# EAGLE design ostc_v2 (EAGLE 6.4)
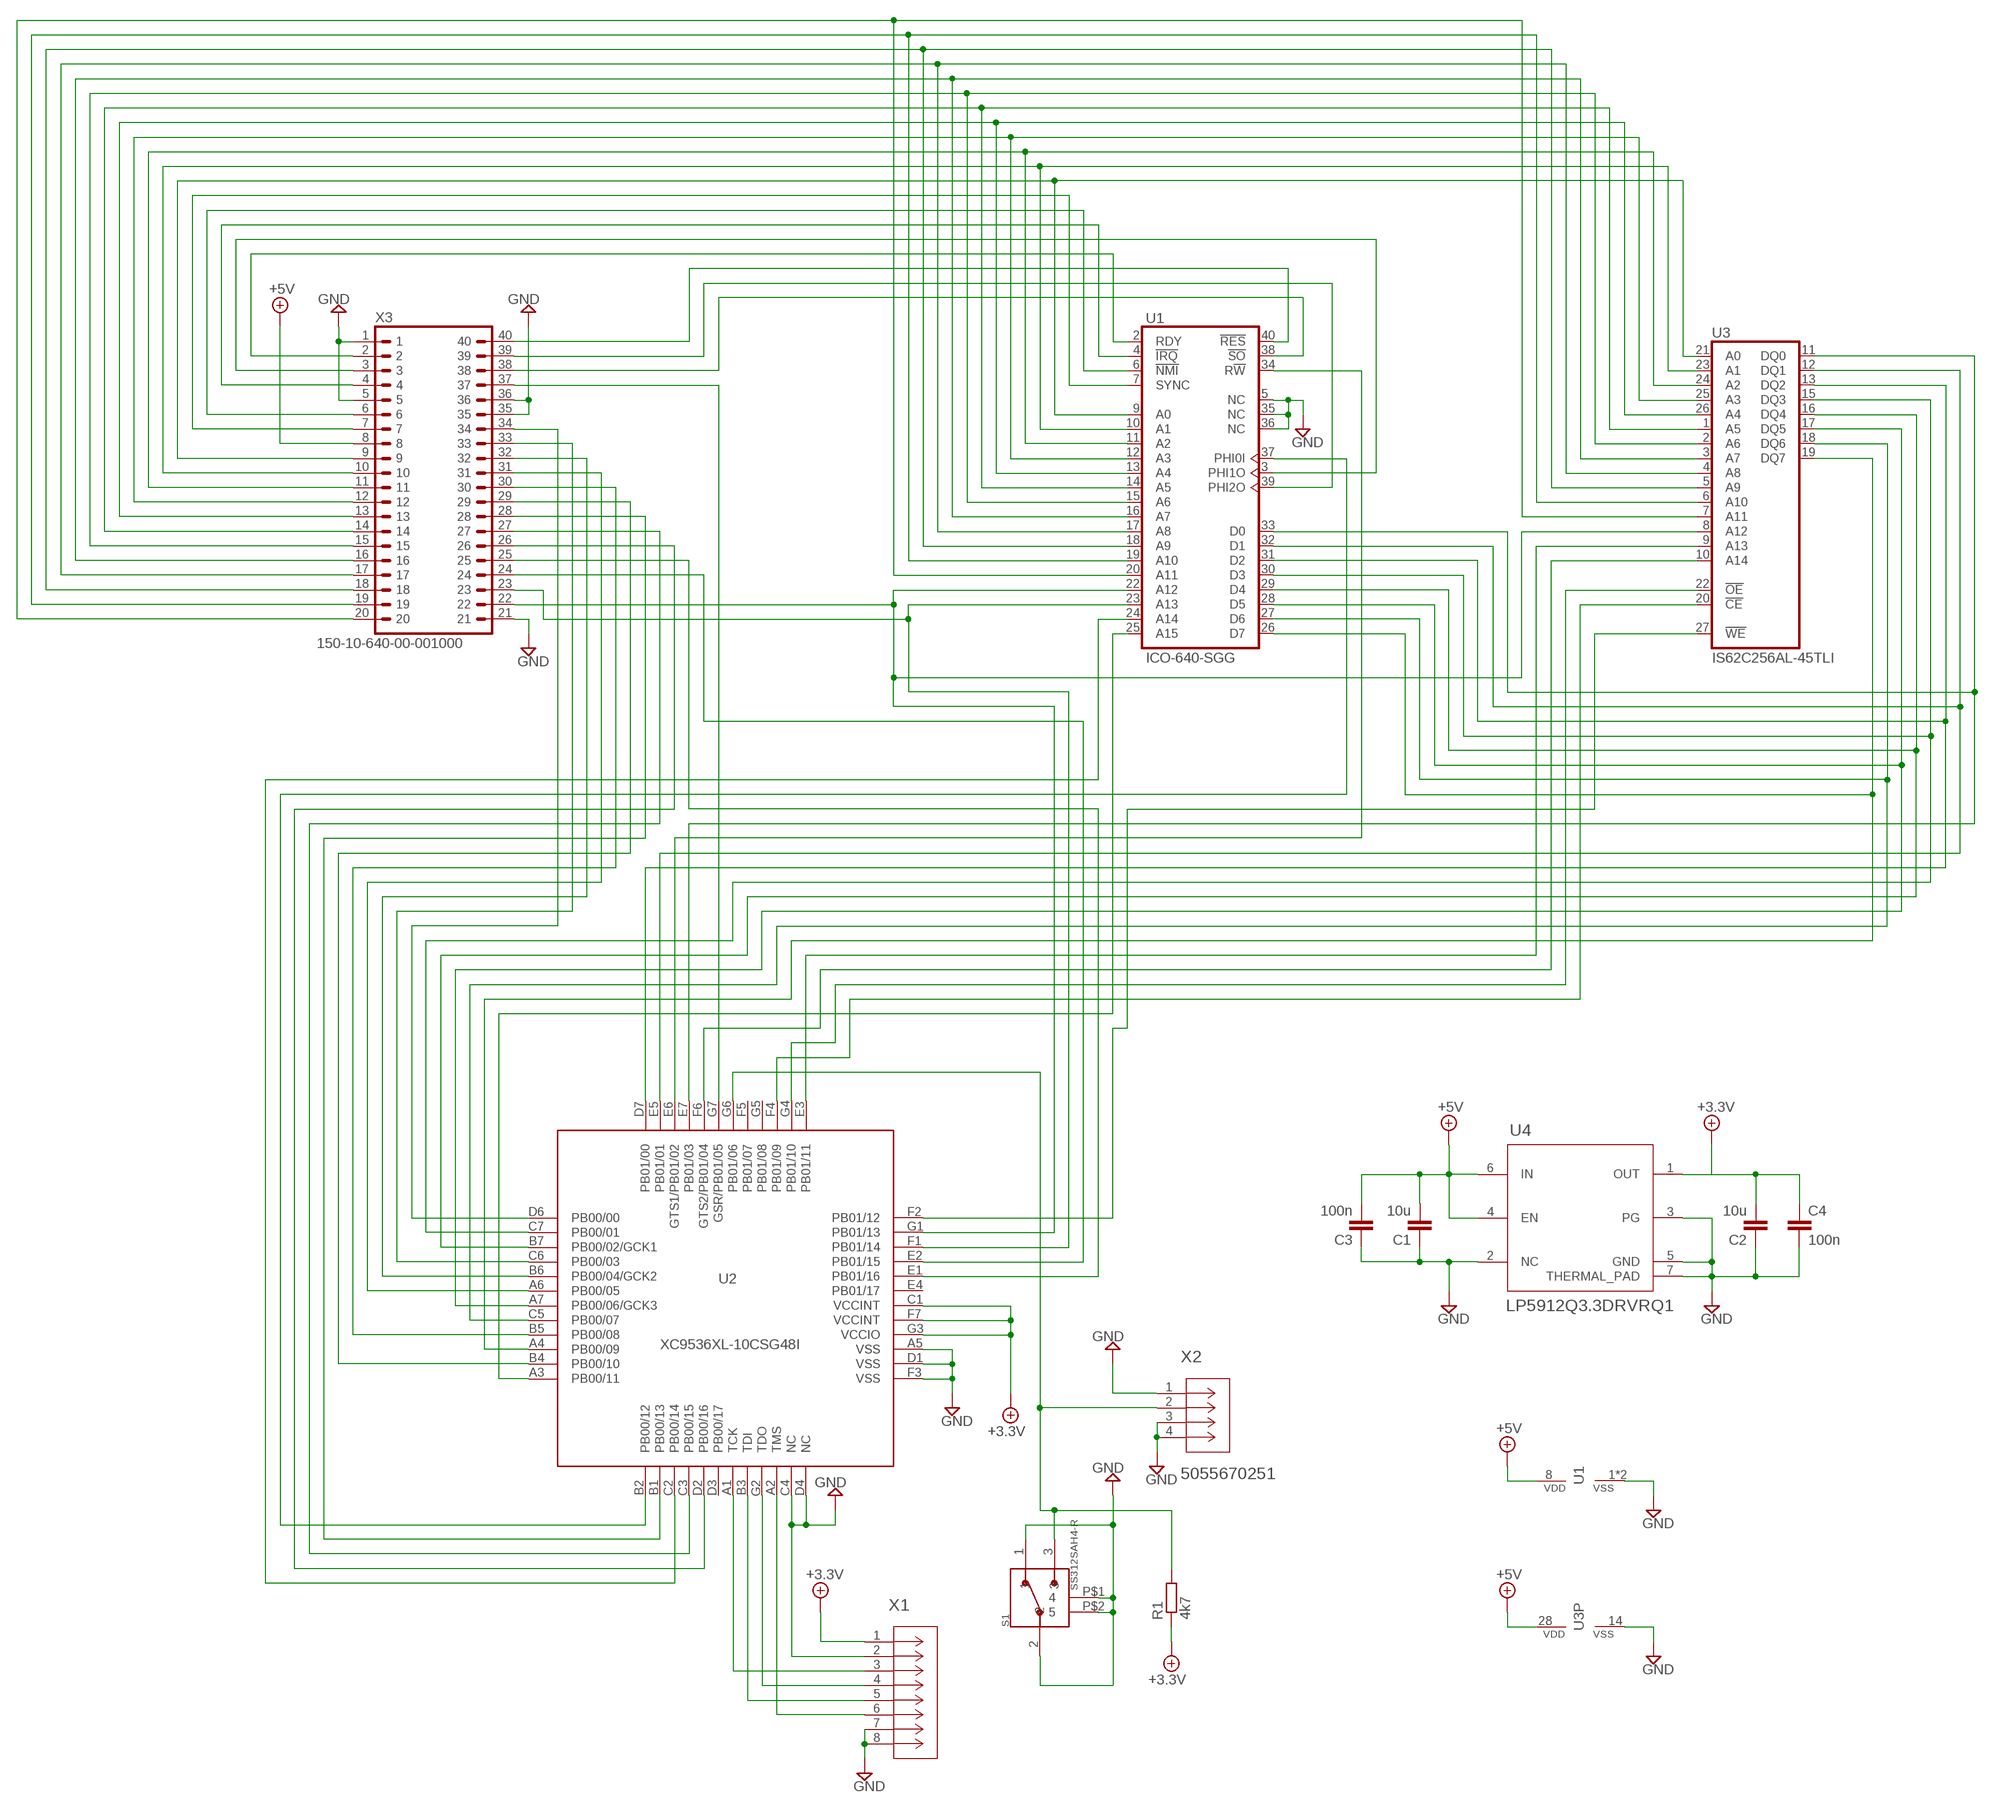
[diagram p0: schematic, sheet 1]

## Parts
C1  10u  C-EUC1206K  [C1206K]
C2  10u  C-EUC1206K  [C1206K]
C3  100n  C-EUC1206K  [C1206K]
C4  100n  C-EUC1206K  [C1206K]
R1  4k7  R-EU_R0805  [R0805]
S1  SS312SAH4-R  [SW_SS312SAH4-R]
U1  ICO-640-SGG  6502SAMTEC_ICO_S  [DIL40_LOWPROFILE]
U2  XC9536XL-10CSG48I  CX9536_CS48  [CSBGA48]
U3  IS62C256AL-45TLI  CY62256LL-ZC  [TSOP1-28]
U4  LP5912Q3.3DRVRQ1  LP5912-3.0DRVT  [DRV0006A-IPC_A]
X1  5055670651  [CON_5055670651]
X2  5055670251  [CON_5055670251]
X3  150-10-640-00-001000  DIL40  [DIL40]

## Nets
+3.3V: C2.2 C4.1 R1.1 U2.C1(VCCINT) U2.F7(VCCINT) U2.G3(VCCIO) U4.1(OUT) X1.1
+5V: C1.2 C3.2 U1.8(VDD) U3.28(VDD) U4.4(EN) U4.6(IN) X3.8
GND: C1.1 C2.1 C3.1 C4.2 S1.1 S1.2 S1.P$1 S1.P$2 U1.1(VSS) U1.5(NC) U1.21(VSS) U1.35(NC) U1.36(NC) U2.A5(VSS) U2.C4(NC) U2.D1(VSS) U2.D4(NC) U2.F3(VSS) U3.14(VSS) U4.2(NC) U4.3(PG) U4.5(GND) U4.7(THERMAL_PAD) X1.2 X1.7 X1.8 X2.1 X2.3 X2.4 X3.1 X3.5 X3.21 X3.35 X3.36
N$1: U1.2(RDY) X3.2
N$2: U1.3(PHI1O) X3.3
N$3: U1.4(!IRQ) X3.4
N$4: U1.6(!NMI) X3.6
N$5: U1.7(SYNC) X3.7
N$6: U1.9(A0) U3.21(A0) X3.9
N$7: U1.10(A1) U3.23(A1) X3.10
N$8: U1.11(A2) U3.24(A2) X3.11
N$9: U1.12(A3) U3.25(A3) X3.12
N$10: U1.13(A4) U3.26(A4) X3.13
N$11: U1.14(A5) U3.1(A5) X3.14
N$12: U1.15(A6) U3.2(A6) X3.15
N$13: U1.16(A7) U3.3(A7) X3.16
N$14: U1.17(A8) U3.4(A8) X3.17
N$15: U1.18(A9) U3.5(A9) X3.18
N$16: U1.19(A10) U3.6(A10) X3.19
N$17: U1.20(A11) U3.7(A11) X3.20
N$18: U2.E2(PB01/15) X3.24
N$19: U1.22(A12) U2.G1(PB01/13) U3.8(A12) X3.22
N$20: U1.23(A13) U2.F1(PB01/14) X3.23
N$21: U2.E1(PB01/16) X3.25
N$22: U2.D2(PB00/16) X3.26
N$23: U2.C3(PB00/15) X3.27
N$24: U2.B1(PB00/13) X3.28
N$25: U2.B4(PB00/10) X3.29
N$26: U2.B5(PB00/08) X3.30
N$27: U2.A6(PB00/05) X3.31
N$28: U2.B6(PB00/04/GCK2) X3.32
N$29: U2.C6(PB00/03) X3.33
N$30: U2.D6(PB00/00) X3.34
N$31: U2.G7(GSR/PB01/05) X3.37
N$32: U1.38(!SO) X3.38
N$33: U1.39(PHI2O) X3.39
N$34: U1.40(!RES) X3.40
N$35: U1.37(PHI0I) U2.B2(PB00/12)
N$36: U1.34(R!W) U2.E6(GTS1/PB01/02)
N$37: U1.33(D0) U2.E7(PB01/03) U3.11(DQ0)
N$38: U1.32(D1) U2.E5(PB01/01) U3.12(DQ1)
N$39: U1.31(D2) U2.D7(PB01/00) U3.13(DQ2)
N$40: U1.30(D3) U2.C7(PB00/01) U3.15(DQ3)
N$41: U1.29(D4) U2.B7(PB00/02/GCK1) U3.16(DQ4)
N$42: U1.28(D5) U2.A7(PB00/06/GCK3) U3.17(DQ5)
N$43: U1.27(D6) U2.C5(PB00/07) U3.18(DQ6)
N$44: U1.26(D7) U2.A4(PB00/09) U3.19(DQ7)
N$45: R1.2 S1.3 U2.G6(PB01/06) X2.2
N$47: U2.E3(PB01/11) U3.9(A13)
N$48: U2.F6(GTS2/PB01/04) U3.10(A14)
N$49: U2.G4(PB01/10) U3.22(!OE)
N$50: U2.F4(PB01/09) U3.20(!CE)
N$51: U2.F2(PB01/12) U3.27(!WE)
N$53: U1.25(A15) U2.A3(PB00/11)
N$54: U1.24(A14) U2.C2(PB00/14)
N$55: U2.A2(TMS) X1.6
N$56: U2.B3(TDI) X1.5
N$57: U2.G2(TDO) X1.4
N$58: U2.A1(TCK) X1.3
Unconnected: U2.D3(PB00/17) U2.E4(PB01/17) U2.F5(PB01/07) U2.G5(PB01/08)

## Library data of the parts
C1-C4 = resistor:C-EU: CAPACITOR, European symbol
R1 = resistor:R-EU_: RESISTOR, European symbol
S1 = SS312SAH4-R:SS312SAH4-R: Switch Slide ON None ON SPDT Side Slide 0.1A 28VAC 28VDC 0.4VA 10000Cycles Gull Wing SMD T/R; MANUFACTURER: NKK switches
U1 = 6502:6502: R6502 by Rockwell
U2 = xilinx-xc9:CX9536_CS48
U3 = memory-sram:CY62256LL-?*: 256K (32K x 8) CMOS-Static RAM Source: http://download.cypress.com.edgesuite.net/design_resources/datasheets/contents/cy62256_8.pdf
U4 = texas:LP5912-3.0DRVT; COPYRIGHT: Copyright (C) 2024 Ultra Librarian. All rights reserved.; MANUFACTURER_PART_NUMBER: LP5912-3.0DRVT; MFR_NAME: Texas Instruments; REFDES: RefDes; TYPE: TYPE
X1 = con-molex:5055670651; COPYRIGHT: Copyright (C) 2024 Ultra Librarian. All rights reserved.; MANUFACTURER_PART_NUMBER: 5055670651; MFR_NAME: Molex Connector Corporation
X2 = con-molex:5055670251; COPYRIGHT: Copyright (C) 2024 Ultra Librarian. All rights reserved.; MANUFACTURER_PART_NUMBER: 5055670251; MFR_NAME: Molex Connector Corporation
X3 = DIL-header:DIL40: DIL Header 40-pin

## Board
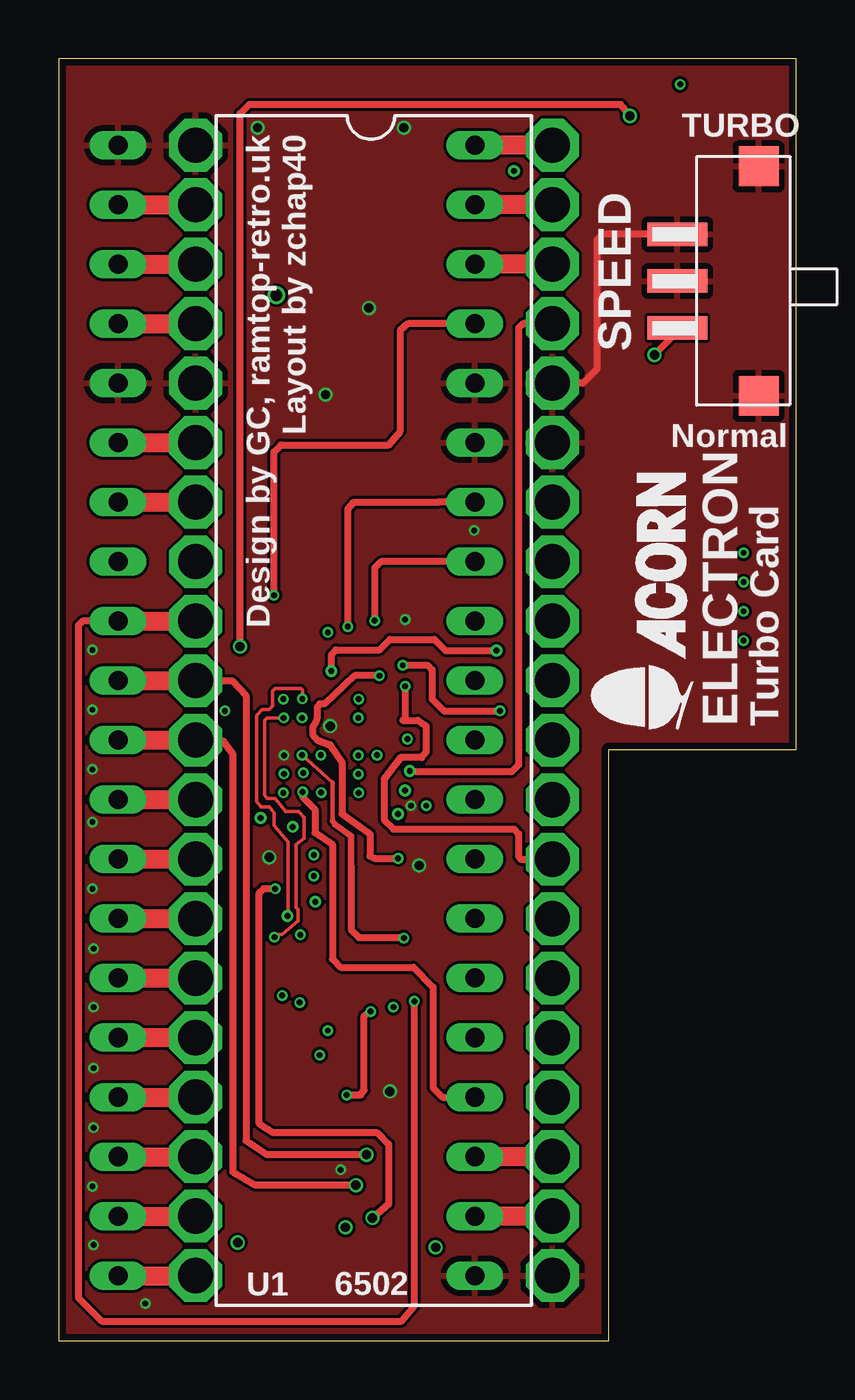
[diagram p1: board, top side]
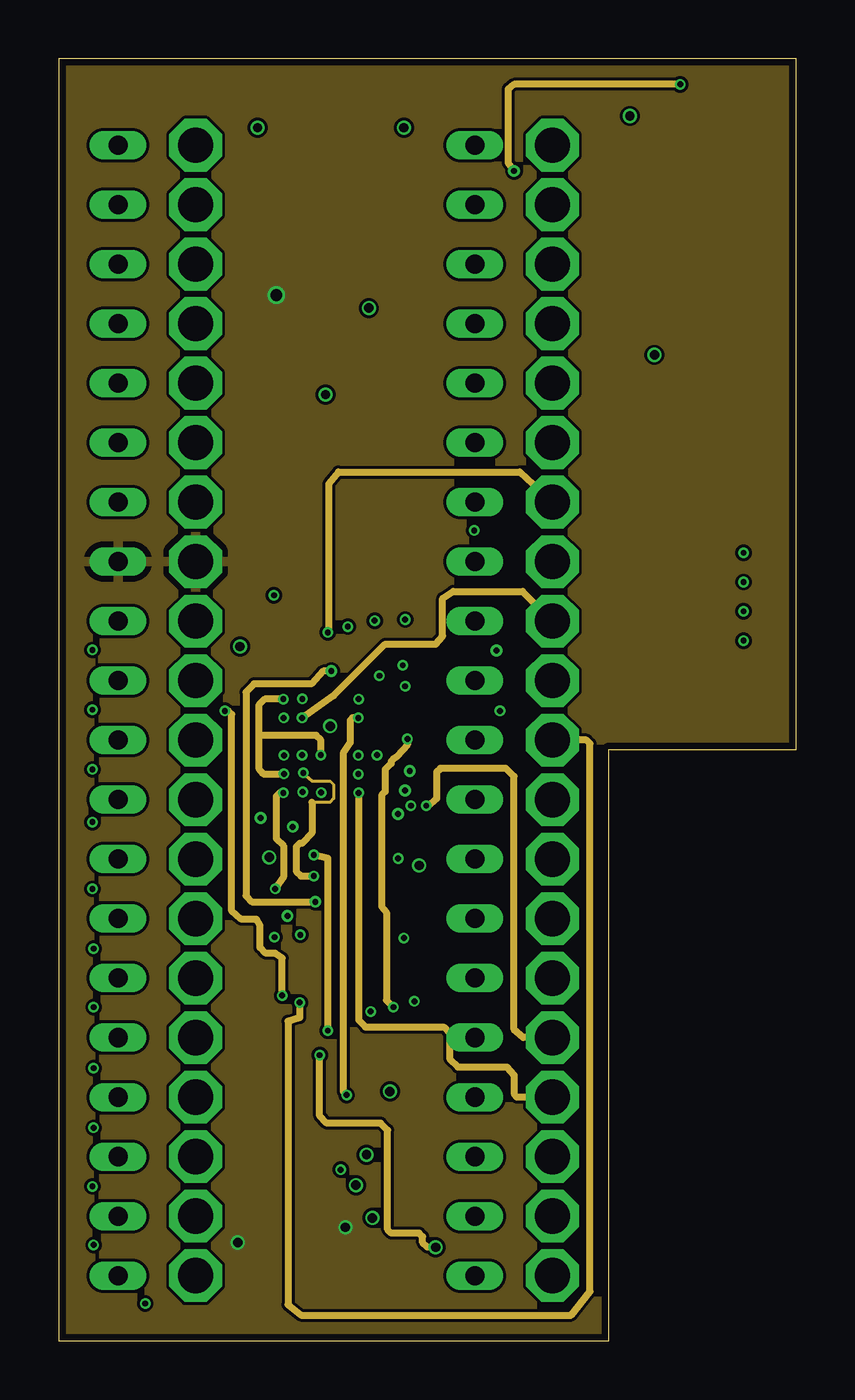
[diagram p2: board, inner layer Route2]
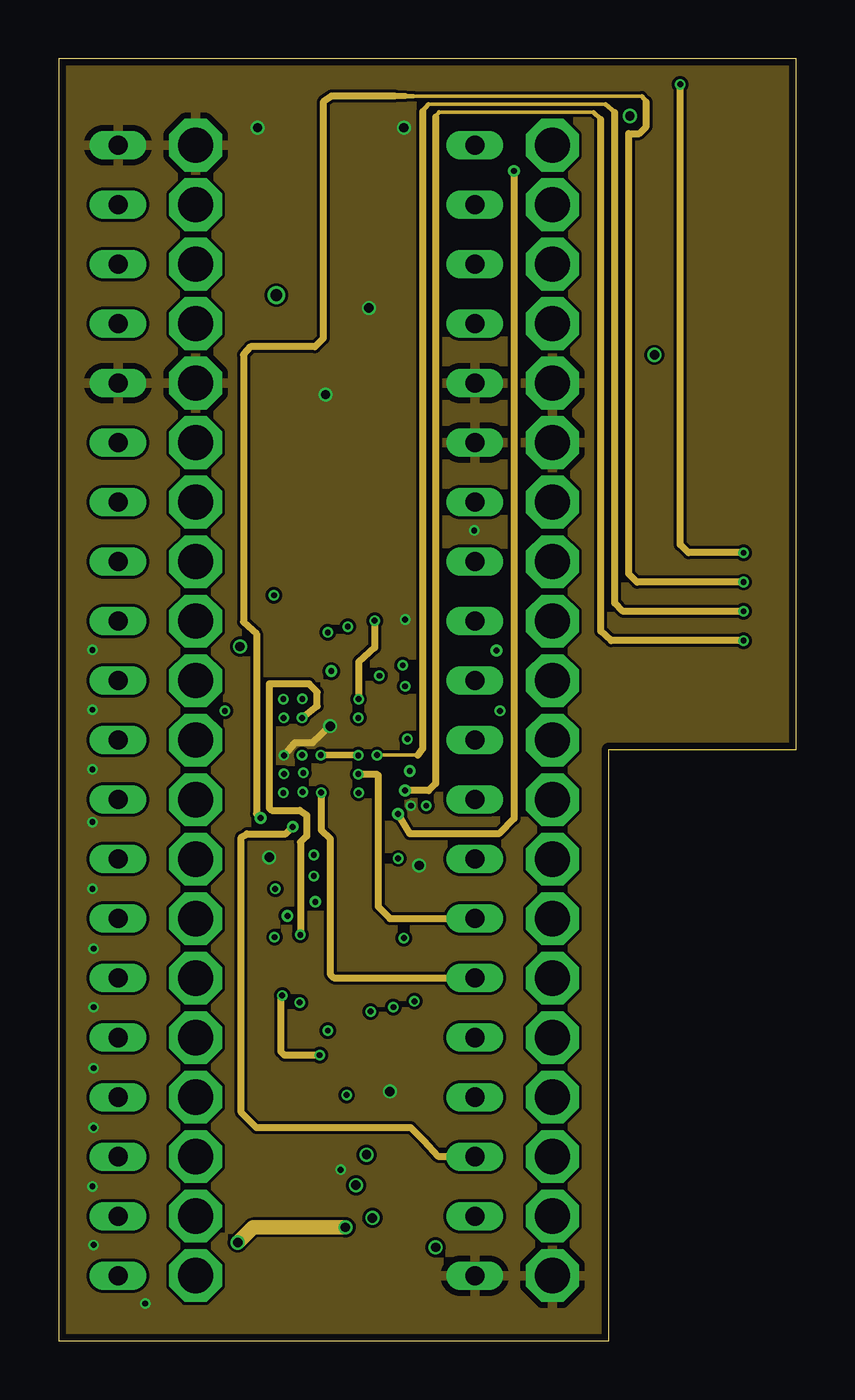
[diagram p3: board, inner layer Route15]
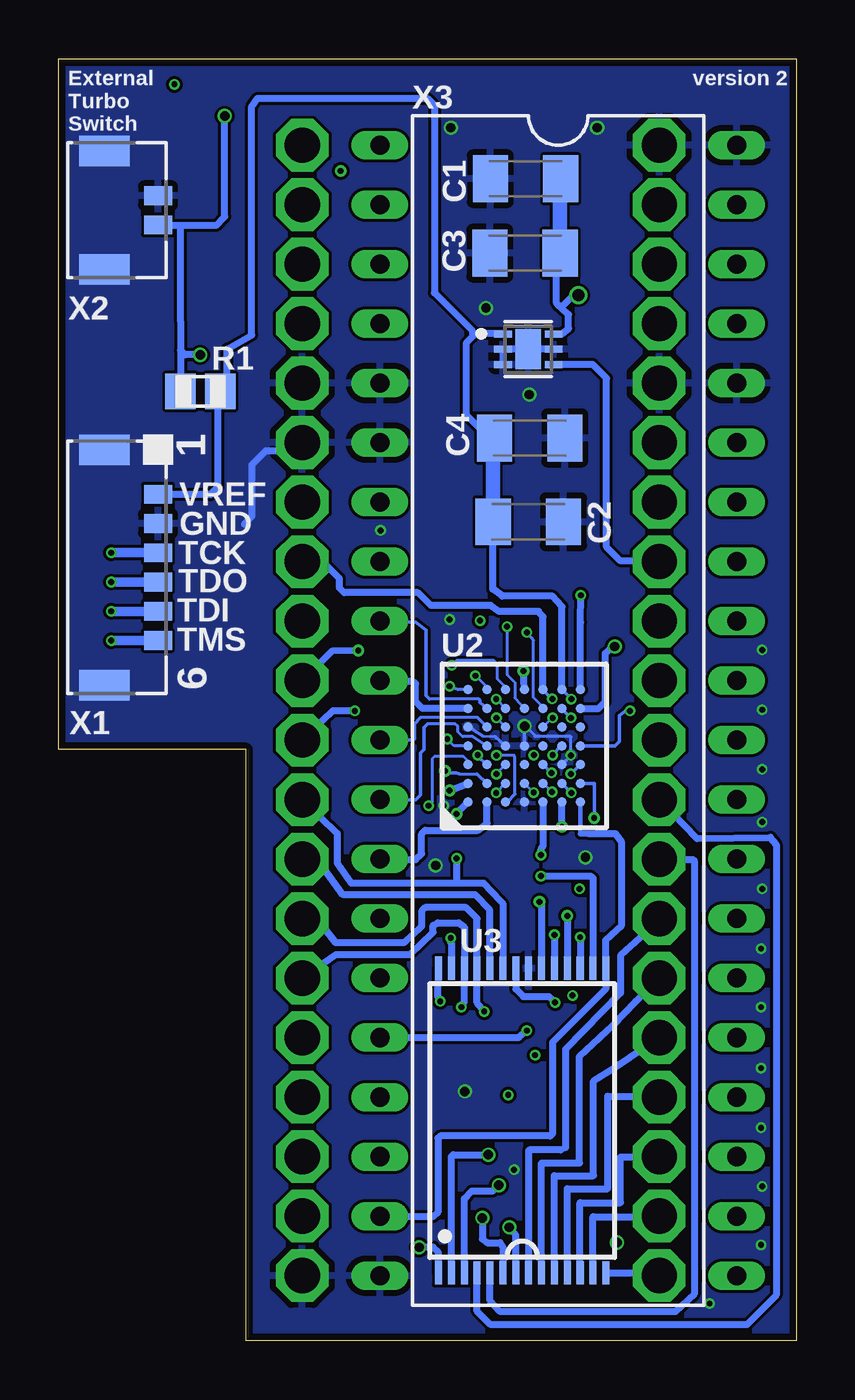
[diagram p4: board, bottom side, seen from below]

Size 31.5 x 54.75 mm. Coordinates in mm from the lower left corner, seen from the top.
Outline: 0,0 23.5,0 23.5,25.25 31.5,25.25 31.5,54.75 0,54.75 0,0
Copper layers (1+2*15+16): Top 0.035mm / dielectric 0.138mm / Route2 0.035mm / dielectric 1.13mm / Route15 0.035mm / dielectric 0.138mm / Bottom 0.035mm
Design rules "aisler_4_layer_complex *": minimum track width 0.125mm, minimum drill 0.1mm, track to track 0.125mm, track to pad 0.125mm, pad to pad 0.125mm, via to via 0.125mm, smd to smd 0mil, copper to edge 0.3mm, drill to drill 0.3mm, minimum pad ring 0.2mm, minimum via ring 0.1mm, stop-mask expansion 0mil, vias tented up to drill 0.3mm, thermal gap 10mil

### Footprints (pad centres in the part's own frame; a part is rotated, then mirrored left to right if it is on the bottom)
C1206K = smd 1.5 x 2: 1 -1.5,0; 2 1.5,0
R0805 = smd 1.3 x 1.5: 1 -0.85,0; 2 0.85,0
SW_SS312SAH4-R = smd 2.55 x 1: 1 1.525,-2; 2 1.525,0; 3 1.525,2 | smd 1.7 x 1.7: P$1 -1.95,-4.9; P$2 -1.95,4.9
DIL40_LOWPROFILE = drill 1.5 octagon: 1 -24.13,-7.62; 2 -21.59,-7.62; 3 -19.05,-7.62; 4 -16.51,-7.62; 5 -13.97,-7.62; 6 -11.43,-7.62; 7 -8.89,-7.62; 8 -6.35,-7.62; 9 -3.81,-7.62; 10 -1.27,-7.62; 11 1.27,-7.62; 12 3.81,-7.62; 13 6.35,-7.62; 14 8.89,-7.62; 15 11.43,-7.62; 16 13.97,-7.62; 17 16.51,-7.62; 18 19.05,-7.62; 19 21.59,-7.62; 20 24.13,-7.62; 21 24.13,7.62; 22 21.59,7.62; 23 19.05,7.62; 24 16.51,7.62; 25 13.97,7.62; 26 11.43,7.62; 27 8.89,7.62; 28 6.35,7.62; 29 3.81,7.62; 30 1.27,7.62; 31 -1.27,7.62; 32 -3.81,7.62; 33 -6.35,7.62; 34 -8.89,7.62; 35 -11.43,7.62; 36 -13.97,7.62; 37 -16.51,7.62; 38 -19.05,7.62; 39 -21.59,7.62; 40 -24.13,7.62
CSBGA48 = smd 0.4 x 0.4: A1 -2,2.8; A2 -1.2,2.8; A3 -0.4,2.8; A4 0.4,2.8; A5 1.2,2.8; A6 2,2.8; A7 2.8,2.8; B1 -2,2; B2 -1.2,2; B3 -0.4,2; B4 0.4,2; B5 1.2,2; B6 2,2; B7 2.8,2; C1 -2,1.2; C2 -1.2,1.2; C3 -0.4,1.2; C4 0.4,1.2; C5 1.2,1.2; C6 2,1.2; C7 2.8,1.2; D1 -2,0.4; D2 -1.2,0.4; D3 -0.4,0.4; D4 0.4,0.4; D6 2,0.4; D7 2.8,0.4; E1 -2,-0.4; E2 -1.2,-0.4; E3 -0.4,-0.4; E4 0.4,-0.4; E5 1.2,-0.4; E6 2,-0.4; E7 2.8,-0.4; F1 -2,-1.2; F2 -1.2,-1.2; F3 -0.4,-1.2; F4 0.4,-1.2; F5 1.2,-1.2; F6 2,-1.2; F7 2.8,-1.2; G1 -2,-2; G2 -1.2,-2; G3 -0.4,-2; G4 0.4,-2; G5 1.2,-2; G6 2,-2; G7 2.8,-2
TSOP1-28 = smd 1 x 0.3: 1 -6.5,-0.275; 2 -6.5,-0.825; 3 -6.5,-1.375; 4 -6.5,-1.925; 5 -6.5,-2.475; 6 -6.5,-3.025; 7 -6.5,-3.575; 8 6.5,-3.575; 9 6.5,-3.025; 10 6.5,-2.475; 11 6.5,-1.925; 12 6.5,-1.375; 13 6.5,-0.825; 14 6.5,-0.275; 15 6.5,0.275; 16 6.5,0.825; 17 6.5,1.375; 18 6.5,1.925; 19 6.5,2.475; 20 6.5,3.025; 21 6.5,3.575; 22 -6.5,3.575; 23 -6.5,3.025; 24 -6.5,2.475; 25 -6.5,1.925; 26 -6.5,1.375; 27 -6.5,0.825; 28 -6.5,0.275
DRV0006A-IPC_A = smd 0.756 x 0.292: 1 -1.078,0.65; 2 -1.078,0; 3 -1.078,-0.65; 4 1.078,-0.65; 5 1.078,0; 6 1.078,0.65 | smd 1.1 x 1.7: 7 0,0
CON_5055670651 = smd 0.8 x 1.2: 1 0,0; 2 -1.25,0; 3 -2.5,0; 4 -3.75,0; 5 -5,0; 6 -6.25,0 | smd 1.3 x 2.15: 7 1.9,2.295; 8 -8.15,2.295
CON_5055670251 = smd 0.8 x 1.2: 1 0,0; 2 -1.25,0 | smd 1.3 x 2.15: 3 1.9,2.295; 4 -3.15,2.295
DIL40 = drill 0.813 long: 1 -24.13,-7.62; 2 -21.59,-7.62; 3 -19.05,-7.62; 4 -16.51,-7.62; 5 -13.97,-7.62; 6 -11.43,-7.62; 7 -8.89,-7.62; 8 -6.35,-7.62; 9 -3.81,-7.62; 10 -1.27,-7.62; 11 1.27,-7.62; 12 3.81,-7.62; 13 6.35,-7.62; 14 8.89,-7.62; 15 11.43,-7.62; 16 13.97,-7.62; 17 16.51,-7.62; 18 19.05,-7.62; 19 21.59,-7.62; 20 24.13,-7.62; 21 24.13,7.62; 22 21.59,7.62; 23 19.05,7.62; 24 16.51,7.62; 25 13.97,7.62; 26 11.43,7.62; 27 8.89,7.62; 28 6.35,7.62; 29 3.81,7.62; 30 1.27,7.62; 31 -1.27,7.62; 32 -3.81,7.62; 33 -6.35,7.62; 34 -8.89,7.62; 35 -11.43,7.62; 36 -13.97,7.62; 37 -16.51,7.62; 38 -19.05,7.62; 39 -21.59,7.62; 40 -24.13,7.62

### Placement (x,y rotation side)
C1  11.56,49.62 0 bottom
C2  11.44,34.97 180 bottom
C3  11.58,46.44 0 bottom
C4  11.38,38.55 0 bottom
R1  25.44,40.54 180 bottom
S1  27.95,45.25 180 top
U1  13.47,26.92 270 top
U2  11.21,25.01 90 bottom
U3  11.7,9.41 90 bottom
U4  11.44,42.34 0 bottom
X1  27.25,36.15 90 bottom
X2  27.25,48.9 90 bottom
X3  10.16,26.92 270 top

### Tracks (layer width: path | path; a pad name or v marks a point on that pad's centre or on a via)
+3.3V  (via drill 0.25)
  Route2 0.305: v11.2,25.01 11.2,25.65 11,25.85 8.55,25.85 | 8.55,25.85 8.55,24.45 8.74,24.21 v9.62,24.21 | v9.6,27.4 8.8,27.4 8.55,27.15 8.55,25.85
  Route15 0.305: v12.8,25 v11.2,25.01
  Bottom 0.125: 12.01,23.35 12.01,24.95 12.05,25 v12.8,25
  Bottom 0.15: U2.G3 9.57,24.25 v9.62,24.21 | U2.F7 10.01,27.76 9.96,27.76 v9.6,27.4 | U2.C1 12.34,23.01 12.01,23.35
  Bottom 0.305: U4.1 13.7,43 13.82,42.88 | 13.82,42.88 14.1,42.6 14.1,39.55 13.1,38.55 C4.1 | U2.F7 10,31.35 10.4,31.8 12.55,31.8 12.95,32.1 C2.2 | 13.82,42.88 13.82,43.12 15.45,44.75 15.45,52.75 15.75,53.05 23,53.05 23.25,52.7 23.25,42.95 24.3,42.35 24.3,40.6 24.65,40.6 R1.1 24.7,40.43 24.7,36.45 25.02,36.12 27.25,36.12 X1.1
  Bottom 0.61: C2.2 12.94,38.49 C4.1
+5V  (via drill 0.4, 0.5)
  Route15 0.61: v12.25,4.85 8.3,4.85 v7.65,4.2
  Bottom 0.305: U1.8 5.88,33.3 7.5,33.3 8.1,33.9 8.1,41.1 8.69,41.69 U4.4 | U4.6 10,43 9.73,43.23 9.73,43.83 10.05,44.11 | C3.2 10.25,46.16 10.25,44.35 10.18,44.23 10.05,44.11 | U3.28 11.97,4.51 v12.25,4.85 | v9.3,44.65 9.51,44.65 10.05,44.11
  Bottom 0.61: C3.2 10.08,49.6 C1.2
  pour Route2: 0,0 0,54.75 31.5,54.75 31.5,25.25 23.5,25.25 23.5,0
GND  (via drill 0.25 pad 0.4, 0.25 pad 0.45, 0.4, 0.4 pad 0.45)
  Top 0.305: S1.1 23.25,47.25 23,47 23,41.5 22.39,40.89 U1.36
  Route15 0.305: v9.62,25 9.62,25.02 10.1,25.55 10.85,25.55 v11.6,26.25
  Bottom 0.125: 13.78,26.09 13.38,25.82 12.86,25.81 | v9.62,25 9.61,25.8 11.15,25.8 11.15,25.85 11.55,26.25 v11.6,26.25
  Bottom 0.15: 12.38,25.41 U2.C4 12.86,25.81 | U2.A5 13.88,26.21 13.78,26.09 | U2.D4 v11.6,26.25 | U2.F3 v9.62,25
  Bottom 0.305: 13,49.68 C1.1 12.95,49.51 | U4.3 U4.2 11.56,42.34 11.5,42.4 U4.7 U4.5 | 10.4,38.62 C4.2 10.35,38.52 | U1.35 21.44,38 22.65,38 23.25,37.4 23.25,35.2 23.57,34.88
  other vias: 9,20.65 1.45,29.5 1.45,26.95 1.45,24.4 1.45,19.3 1.5,16.75 1.5,14.25 1.5,11.65 1.5,9.1 1.45,6.6 1.5,4.1 15.4,20.3 14.15,10.65 11.4,40.4 13.25,44.1 14.75,51.8 8.5,51.8 3.7,1.6 1.45,22.15 17.75,34.6 12.05,7.31 15.05,22.85 14.8,30.8
  pour Route15: 0,54.75 31.5,54.75 31.5,25.25 23.5,25.25 23.5,0 0,0
  pour Bottom: 0,54.75 31.5,54.75 31.5,25.25 23.5,25.25 23.5,0 0,0
  pour Top: 0,54.75 31.5,54.75 31.5,25.25 23.5,25.25 23.5,0 0,0
N$1
  Top 0.813: X3.2 U1.2
N$2
  Top 0.813: X3.3 U1.3
N$3
  Top 0.813: X3.4 U1.4
N$4
  Top 0.813: X3.6 U1.6
N$5
  Top 0.813: X3.7 U1.7
N$6  (via drill 0.25)
  Top 0.305: U1.9 1.03,30.73 0.85,30.55 0.85,1.85 1.85,0.85 14.65,0.85 15.2,1.5 v15.2,14.5
  Top 0.813: X3.9 U1.9
  Bottom 0.305: v15.2,14.5 15.3,14.7 15.29,15.9 U3.21
N$7  (via drill 0.4)
  Top 0.305: U1.10 7.41,28.19 8,27.55 8,8.55 8.9,7.95 v13.15,7.95
  Top 0.813: X3.10 U1.10
  Bottom 0.305: U3.23 14.72,7.88 14.65,7.95 v13.15,7.95
N$8  (via drill 0.4)
  Top 0.305: v12.7,6.65 8.4,6.65 7.45,7.2 7.45,25.05 7.05,25.6 5.9,25.6 U1.11
  Top 0.813: X3.11 U1.11
  Bottom 0.305: U3.24 14.18,6.08 13.85,6.4 12.95,6.4 v12.7,6.65
N$9
  Top 0.813: X3.12 U1.12
  Bottom 0.305: U1.12 4.24,21.45 1.1,21.5 0.85,21.2 0.85,1.95 2.1,0.7 13.05,0.7 13.62,1.27 U3.25
N$10
  Top 0.813: X3.13 U1.13
  Bottom 0.305: U1.13 5.83,20.55 4.4,20.55 4.35,20.5 4.35,2 5.15,1.25 12.65,1.25 13.07,1.73 U3.26
N$11
  Top 0.813: X3.14 U1.14
  Bottom 0.305: U1.14 5.85,17.95 7.5,16.45 7.5,14.85 9.85,12.45 9.85,8.25 10.05,8.15 11.4,8.15 11.43,8.12 U3.1
N$12
  Top 0.813: X3.15 U1.15
  Bottom 0.305: U3.2 10.88,7.6 9.25,7.6 9.25,12.15 7.8,13.5 6.85,14.5 5.85,15.45 U1.15
N$13
  Top 0.813: X3.16 U1.16
  Bottom 0.305: U3.3 10.33,7.05 8.65,7.05 8.65,11.1 7.7,11.7 U1.16
N$14
  Top 0.813: X3.17 U1.17
  Bottom 0.305: U3.4 9.77,6.46 9.77,6.5 8.05,6.5 8.05,10.45 5.85,10.45 U1.17
N$15
  Top 0.813: X3.18 U1.18
  Bottom 0.305: U3.5 9.23,5.9 7.5,5.9 7.5,7.85 5.85,7.85 U1.18
N$16
  Top 0.813: X3.19 U1.19
  Bottom 0.305: U3.6 8.68,5.3 5.85,5.3 U1.19
N$17
  Top 0.813: X3.20 U1.20
  Bottom 0.305: U3.7 5.85,2.91
  Bottom 0.406: 5.85,2.91 U1.20
N$18  (via drill 0.25 pad 0.45)
  Top 0.305: v10.43,23.44 10.43,23.23 10.95,22.7 10.95,21.7 11.7,21.2 11.7,16.3 12.05,15.95 15.15,15.95 16,15.1 16,10.8 16.4,10.4 X3.24
  Bottom 0.125: U2.E2 10.8,23.81 v10.43,23.44
N$19
  Top 0.813: U1.22 X3.22
  Bottom 0.2: 9.21,21.65 U2.G1
  Bottom 0.25: 8.85,21.65 9.21,21.65
  Bottom 0.275: 8.55,21.65 8.85,21.65
  Bottom 0.305: U3.8 8.13,17.12 7.45,17.75 7.45,21.3 7.7,21.65 8.55,21.65 | U3.8 | U3.8 8.13,15.02 10.4,12.75 10.4,8.85 10.5,8.75 15.2,8.75 15.3,8.65 15.3,5.5 15.5,5.3 17.75,5.3 X3.22
N$20  (via drill 0.25 pad 0.5)
  Top 0.813: U1.23 X3.23
  Route15 0.305: X3.23 16.23,7.87 15.6,8.55 15.05,9.1 8.45,9.1 7.8,9.75 7.8,21.5 8.05,21.65 9.7,21.65 v10,21.95
  Bottom 0.305: v10,21.95 U2.F1
N$21  (via drill 0.25 pad 0.45)
  Route2 0.305: v11.5,13.25 11.5,20.6 v10.9,20.75
  Bottom 0.305: X3.25 11.85,12.95 v11.5,13.25 | v10.9,20.75 10.9,21 10.8,21.15 U2.E1
N$22  (via drill 0.25 pad 0.45)
  Route15 0.305: v11.21,23.41 11.21,21.81 11.6,21.45 11.6,15.65 11.75,15.5 X3.26
  Bottom 0.125: U2.D2 v11.21,23.41
N$23  (via drill 0.25 pad 0.45)
  Route15 0.305: v12.8,24.2 13.6,24.2 13.65,24.15 13.65,18.55 14.15,18.04 X3.27
  Bottom 0.125: U2.C3 12.44,24.61 v12.8,24.2
N$24
  Bottom 0.305: X3.28 17.76,20.55 16.25,20.55 16,20.8 16,21.65 15.85,21.8 13.6,21.8 13.2,22.1 U2.B1
N$25
  Bottom 0.125: U2.B4 13.8,25.8 14.25,25.8 14.45,26 14.45,26.25 14.55,26.35 15.75,26.35
  Bottom 0.15: 15.75,26.35 15.9,26.2 15.9,25.25 16.05,25.1 16.05,23.3 16.25,23.1 X3.29
N$26
  Bottom 0.125: 13.6,26.61 16.05,26.61
  Bottom 0.15: U2.B5 13.6,26.61 | 16.05,26.61 16.3,26.35 16.3,25.7 16.35,25.65 X3.30
N$27
  Bottom 0.305: U2.A6 15.96,27.01 16.25,27.3 16.25,28.05 16.35,28.15 17.74,28.15 X3.31
N$28
  Bottom 0.125: 13.5,27.35 13.55,27.41 15.66,27.41
  Bottom 0.15: U2.B6 13.5,27.25 13.5,27.35 | 15.66,27.41 15.8,27.55 15.8,30.35 16.25,30.7 17.75,30.7 X3.32
N$29  (via drill 0.25 pad 0.45)
  Top 0.305: X3.33 13.78,33.27 13.5,33 v13.5,30.75
  Route15 0.305: v13.5,30.75 13.5,29.6 12.81,28.99 v12.81,27.4
  Bottom 0.125: v12.81,27.4 v12.8,27.4 U2.C6
N$30  (via drill 0.25 pad 0.45)
  Top 0.305: X3.34 16.21,35.81 16.15,35.8 | 16.2,35.8 16.15,35.8 | 16.15,35.8 12.6,35.8 12.35,35.5 v12.35,30.5
  Bottom 0.125: v12.35,30.5 12.35,28.45 12.01,28.11 12.01,27.45 U2.D6
N$31  (via drill 0.25 pad 0.45)
  Top 0.305: v9.2,31.84 9.2,37.95 9.5,38.25 14.1,38.25 14.6,38.85 14.6,43.15 14.95,43.45 17.76,43.45 X3.37
  Bottom 0.305: U2.G7 9.21,30.69 v9.2,31.84
N$32
  Top 0.813: U1.38 X3.38
N$33
  Top 0.813: U1.39 X3.39
N$34
  Top 0.813: U1.40 X3.40
N$35  (via drill 0.25 pad 0.5)
  Top 0.305: U1.37 19.83,43.43 19.65,43.25 19.65,24.6 19.35,24.3 15.25,24.3 v15,24.34
  Bottom 0.125: 14.38,24.21 13.62,24.21
  Bottom 0.15: v15,24.34 14.8,24.25 14.5,24.25 14.38,24.21 | 13.62,24.21 U2.B2
N$36  (via drill 0.25 pad 0.45)
  Route2 0.305: v11.5,30.25 11.5,30.3 11.55,30.35 11.55,36.6 11.95,37.1 19.7,37.1 U1.34
  Bottom 0.125: U2.E6 10.81,27.06 11.21,27.46 11.21,29.91 v11.5,30.25
N$37  (via drill 0.25 pad 0.45, 0.25 pad 0.5)
  Top 0.15: v10.41,27.41 10.41,27.79 10.35,27.85 9.25,27.85 9.15,27.75 9.15,27.1 9,26.95 8.7,26.95 8.46,26.7 8.46,23.04 8.65,22.8 9.01,22.8 9.2,22.55 9.2,22 9.55,21.6 9.8,21.3 9.8,18.2 v9.78,18.15
  Bottom 0.15: U2.E7 10.81,27.76 v10.41,27.41 | 9.78,15.94 U3.11
  Bottom 0.305: U2.E7 10.81,30.91 11,31.15 12.7,31.15 13.05,31.4 15.6,31.4 16.15,31.95 19.3,31.95 19.5,32.15 19.5,32.55 20.22,33.27 U1.33 | v9.78,18.15 9.78,15.94
N$38  (via drill 0.25 pad 0.45)
  Route2 0.305: U1.32 19.82,32 16.85,32 16.4,31.7 16.4,30.1 16.1,29.75 13.95,29.75 11.75,27.55 v10.4,26.6
  Route15 0.305: v10.32,17.34 10.32,21.3 10.6,21.55 10.6,22.45 10.3,22.65 9.1,22.65 9,22.75 9,28.05 10.7,28.05 11.05,27.7 11.05,27.1 v10.4,26.6
  Bottom 0.125: U2.E5 10.81,26.24 v10.4,26.6
  Bottom 0.305: v10.32,17.34 U3.12
N$39  (via drill 0.25 pad 0.5)
  Top 0.305: v11.65,28.6 11.65,29.3 11.85,29.5 13.7,29.5 14.15,29.95 16.05,29.95 16.52,29.48 v18.7,29.48
  Route2 0.305: v11.65,28.6 11.3,28.6 10.8,28.05 8.35,28.05 8,27.7 8,19 8.25,18.75 v10.96,18.75
  Bottom 0.15: U2.D7 11.61,28.59 v11.65,28.6
  Bottom 0.305: U2.D7 v11.65,28.6 | v18.7,29.48 19.83,29.45 U1.31 | v10.96,18.75 10.88,18.61 U3.13
N$40  (via drill 0.25 pad 0.45)
  Top 0.305: v14.7,28.85 15.75,28.85 15.95,28.65 15.95,27.4 16.45,26.9 v18.85,26.9
  Route2 0.305: v10.3,14.45 10.3,13.8 9.8,13.65 9.8,1.55 10.35,1.1 21.9,1.1 22.7,2.1 22.7,25.5 22.55,25.65 U1.30
  Bottom 0.125: U2.C7 12.41,27.91 12.75,28.25 12.75,28.9 12.9,29.05 14.5,29.05 v14.7,28.85
  Bottom 0.305: v18.85,26.9 19.79,26.9 U1.30 | U3.15 11.97,15.03 11.65,14.7 10.55,14.7 v10.3,14.45
N$41  (via drill 0.25 pad 0.45)
  Top 0.305: v13.7,28.4 12.65,28.4 11.35,27.2 11.15,27.2 11.05,27.05 11.05,26.61 10.99,26.44 10.85,26.2 10.85,25.9 11.05,25.65 11.6,25.45 12.1,24.7 12.1,22.5 13.3,21.65 13.3,20.7 13.5,20.6 v14.5,20.6
  Bottom 0.125: U2.B7 13.21,27.91 v13.7,28.4
  Bottom 0.305: U1.29 19.6,21.67 19.6,20.4 19,19.55 14.4,19.55 | 14.4,19.55 13.35,19.55 12.65,18.8 12.53,18.68 U3.16 | v14.5,20.6 14.5,19.6 14.4,19.55
N$42  (via drill 0.25 pad 0.45)
  Top 0.305: v14.8,27.95 14.8,26.6 14.7,26.5 15.35,26.5 15.7,26.25 15.7,25.15 15.5,24.9 14.6,24.9 13.9,24 13.9,22.25 14.3,21.85 19.45,21.85 19.65,21.65 19.65,20.7 19.74,20.56 20.52,20.56 20.6,20.57 U1.28
  Bottom 0.125: U2.A7 14.46,27.81 v14.8,27.95
  Bottom 0.305: U3.17 13.08,15.98 13.08,18.4 13.7,19.05 19.35,19.05 20.47,20.57 U1.28
N$43  (via drill 0.25 pad 0.45)
  Top 0.305: v12.3,10.5 12.9,10.5 13.05,10.7 13.05,13.89 v13.32,14.06
  Route2 0.305: v12.8,26.6 12.55,26.6 12.45,26.5 12.45,25.55 12.15,25.1 12.15,10.65 v12.3,10.5
  Bottom 0.125: U2.C5 v12.8,26.6
  Bottom 0.305: U1.27 20.47,18.03 19.65,17 16.75,17 16,17.7 16,18.35 15.85,18.5 14.1,18.5 13.63,18.03 13.63,15.94 U3.18 13.62,14.44 v13.32,14.06
N$44  (via drill 0.25 pad 0.45)
  Route2 0.305: v14.9,25.7 14.9,25.45 14.45,24.95 14.3,24.85 14.2,24.75 14.2,24.65 13.95,24.4 13.95,23.45 13.8,23.3 13.8,18.55 14,18.3 14,14.55 v14.3,14.25
  Bottom 0.125: U2.A4 14.61,25.41 v14.9,25.7
  Bottom 0.305: U1.26 19.65,16.5 16.5,16.5 15.5,17.45 15.5,17.75 15.3,17.85 14.4,17.85 14.18,17.68 U3.19 14.18,14.47 14.35,14.3 v14.3,14.25
N$45  (via drill 0.4)
  Top 0.305: v7.75,29.65 7.75,52.4 8.15,52.8 24,52.8 v24.4,52.3 | S1.3 26.48,43.12 v25.45,42.1
  Bottom 0.305: U2.G6 8.45,27 8.15,27.3 8.15,29.35 7.85,29.65 v7.75,29.65 | v24.4,52.3 24.4,48 24.77,47.62 26.29,47.62 | 26.3,43.55 26.29,43.55 | 26.29,43.55 26.29,42.3 | 26.29,42.3 R1.2 | v25.45,42.1 26.09,42.1 26.29,42.3 | 26.29,47.62 27.25,47.62 X2.2 | 26.29,43.55 26.29,47.62
N$47  (via drill 0.25 pad 0.45)
  Route2 0.125: 10.82,23.9 11.6,23.9 11.75,23.75 11.75,23.15 11.6,23 10.82,23
  Route2 0.15: v10.45,24.25 10.45,24.24 10.82,23.9
  Route2 0.305: 10.82,23 10.82,21.69 10.4,21.25 10.3,21.25 10.15,21.1 10.15,20.05 10.35,19.85 v10.9,19.85
  Bottom 0.15: U2.E3 v10.45,24.25
  Bottom 0.305: v10.9,19.85 8.78,19.85 8.68,19.75 U3.9
N$48  (via drill 0.25 pad 0.45)
  Top 0.15: v9.61,26.6 8.9,26.6 8.8,26.5 8.8,23.3 8.9,23.15 9.25,23.15 9.55,22.8 9.7,22.6 10.25,22.6 10.47,22.35 10.47,21.46 10.15,21.2 10.15,18.5 10.22,18.43 10.22,17.94 9.55,17.35 9.35,17.35 v9.22,17.24
  Bottom 0.15: U2.F6 10.01,26.99 v9.61,26.6
  Bottom 0.305: v9.22,17.24 U3.10
N$49  (via drill 0.25, 0.4)
  Route2 0.305: v16.1,4 15.75,4 15.55,4.2 15.55,4.45 15.4,4.6 14.2,4.6 14.05,4.75 14.05,9 13.75,9.3 11.45,9.3 11.15,9.6 v11.15,12.2 | v9.55,14.75 9.55,16.35 9.25,16.55 8.85,16.55 8.6,16.8 8.6,17.75 8.45,18 7.8,18 7.4,18.35 7.4,26.75 7.25,26.9 v7.1,26.9
  Route15 0.305: v11.15,12.2 9.65,12.2 9.5,12.35 9.5,14.7 v9.55,14.75
  Bottom 0.15: 9.21,25.46 U2.G4 7.75,25.4 7.55,25.6 7.55,26.7 7.3,26.9 v7.1,26.9
  Bottom 0.305: U3.22 15.28,3.77 15.5,4 v16.1,4
N$50  (via drill 0.25 pad 0.45)
  Top 0.15: v10.4,25.01 10.41,25 11.7,23.85
  Top 0.2: 11.7,23.85 11.7,22.2
  Top 0.225: 11.7,22.2 11.8,22.05
  Top 0.25: 11.8,22.05 12.5,21.55
  Top 0.275: 12.5,21.55 12.5,20.25
  Top 0.29: 12.5,20.25 12.5,20.2
  Top 0.305: 12.5,20.2 12.5,17.55 12.82,17.23 14.72,17.23 v14.75,17.2
  Bottom 0.15: U2.F4 10.04,25.41 v10.4,25.01
  Bottom 0.305: v14.75,17.2 14.75,17.01 14.72,16.99 U3.20
N$51  (via drill 0.25 pad 0.45, 0.4 pad 0.45)
  Top 0.305: v9.25,19.3 8.75,19.3 8.55,19.1 8.55,9.3 9.15,8.9 13.6,8.9 14.1,8.4 14.1,5.85 v13.4,5.25
  Route2 0.305: v9.6,23.4 9.45,23.4 9.3,23.25 9.3,21.45 9.6,21.15 9.6,19.8 v9.25,19.3
  Bottom 0.15: U2.F2 v9.6,23.4
  Bottom 0.305: v13.4,5.25 13.4,4.35 13.2,4.2 12.65,4.2 12.53,4 U3.27
N$53  (via drill 0.25 pad 0.45)
  Route2 0.305: U1.25 19.85,12.95 19.45,13.3 19.45,24.1 19.1,24.45 16.3,24.45 16.15,24.3 16.15,23.15 15.8,22.85 v15.7,22.85
  Bottom 0.125: U2.A3 14.01,24.76 14.2,24.95 15.45,24.95 15.55,24.85 15.55,23 v15.7,22.85
N$54  (via drill 0.25 pad 0.45)
  Route2 0.305: v12.81,23.4 12.81,13.7 13.1,13.4 16.45,13.4 16.7,13.15 16.7,12.05 17.05,11.7 19.15,11.7 19.45,11.35 19.45,10.55 19.56,10.41 U1.24
  Bottom 0.125: U2.C2 12.44,23.81 v12.81,23.4
N$55  (via drill 0.25, 0.25 pad 0.5)
  Route15 0.15: 22.85,52.45 16.25,52.45
  Route15 0.2: 23.15,52.15 22.85,52.45 | 16.25,52.45 16.1,52.25
  Route15 0.305: v29.25,29.9 23.6,29.9 23.15,30.3 23.15,52.15 | 16.1,52.25 16.1,23.8 15.8,23.5 v14.8,23.5
  Bottom 0.305: v14.8,23.5 U2.A2
  Bottom 0.406: X1.6 v29.25,29.9
N$56  (via drill 0.25, 0.25 pad 0.45)
  Route15 0.15: 23.35,52.8 15.8,52.8 | 15.35,25.01 v13.6,25.01
  Route15 0.2: 23.75,52.45 23.35,52.8 | 15.8,52.8 15.55,52.5
  Route15 0.305: v29.25,31.15 24.1,31.15 23.75,31.5 23.75,52.45 | 15.55,52.5 15.55,25.29 15.35,25.01
  Bottom 0.15: v13.6,25.01 13.6,24.96 U2.B3
  Bottom 0.406: X1.5 v29.25,31.15
N$57  (via drill 0.25, 0.25 pad 0.5)
  Route15 0.15: 24.9,53.15 15.15,53.15
  Route15 0.2: 25.1,52.9 24.9,53.15 | 15.15,53.15 14.8,53.15
  Route15 0.25: 14.8,53.15 14.35,53.15
  Route15 0.305: v29.25,32.4 24.7,32.4 24.35,32.75 24.35,51.55 24.8,51.55 25.1,51.85 25.1,52.9 | 14.35,53.15 11.65,53.15 11.3,52.9 11.3,42.8 10.95,42.45 8.2,42.45 7.9,42.1 7.9,30.7 8.45,30.2 8.45,22.51 v8.62,22.32
  Bottom 0.15: v8.62,22.32 8.62,23.8 U2.G2
  Bottom 0.406: X1.4 v29.25,32.4
N$58  (via drill 0.25, 0.25 pad 0.5)
  Route2 0.305: v26.55,53.65 19.45,53.65 19.2,53.45 19.2,50.3 v19.45,49.95
  Route15 0.305: v29.25,33.65 26.9,33.65 26.55,34 v26.55,53.65 | v19.45,49.95 19.45,22.3 18.8,21.65 15,21.65 v14.5,22.5
  Bottom 0.15: v14.5,22.5 14.5,22.52
  Bottom 0.305: 14.5,22.52 U2.A1
  Bottom 0.406: X1.3 v29.25,33.65

### Text on the board
tNames: Design by GC, ramtop-retro.uk / Layout by zchap40 | TURBO | SPEED | Normal | ELECTRON | Turbo Card | 6502
bNames: version 2 | X3 | External / Turbo / Switch | 1 | VREF | GND | TCK | TDO | TDI | 6 | TMS